# Altium schematic sheet buttons.SchDoc
size A4
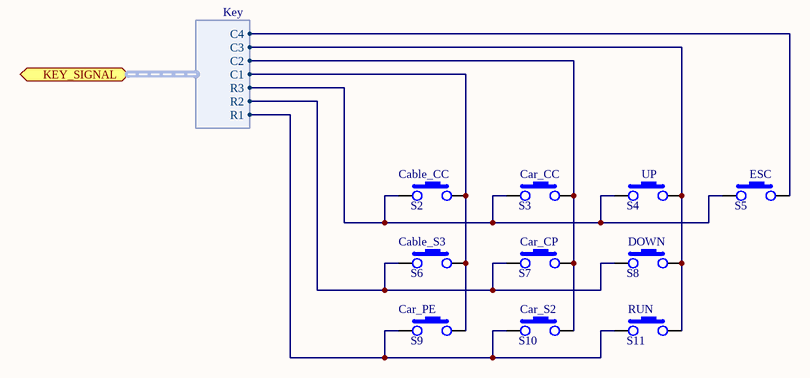
[diagram p0: buttons.SchDoc]

## Parts
S2  SKHCBJA010  [SKHCBJA010]  (value not drawn)
S3  SKHCBJA010  [SKHCBJA010]  (value not drawn)
S4  SKHCBJA010  [SKHCBJA010]  (value not drawn)
S5  SKHCBJA010  [SKHCBJA010]  (value not drawn)
S6  SKHCBJA010  [SKHCBJA010]  (value not drawn)
S7  SKHCBJA010  [SKHCBJA010]  (value not drawn)
S8  SKHCBJA010  [SKHCBJA010]  (value not drawn)
S9  SKHCBJA010  [SKHCBJA010]  (value not drawn)
S10  SKHCBJA010  [SKHCBJA010]  (value not drawn)
S11  SKHCBJA010  [SKHCBJA010]  (value not drawn)

## Ports
KEY_SIGNAL (harness Key)

## Harnesses
Key: R3, R2, R1, C4, C3, C2, C1

## Nets
NetS2_1: S2.1 S3.1 S4.1 S5.1 ; port KEY_SIGNAL.R3
NetS2_3: S2.3 S6.3 S9.3 ; port KEY_SIGNAL.C1
NetS3_3: S3.3 S7.3 S10.3 ; port KEY_SIGNAL.C2
NetS4_3: S4.3 S8.3 S11.3 ; port KEY_SIGNAL.C3
NetS5_3: S5.3 ; port KEY_SIGNAL.C4
NetS6_1: S6.1 S7.1 S8.1 ; port KEY_SIGNAL.R2
NetS9_1: S9.1 S10.1 S11.1 ; port KEY_SIGNAL.R1

## Notes on the sheet
- (near S2) Cable_CC
- (near S3) Car_CC
- (near S4) UP
- (near S5) ESC
- (near S6) Cable_S3
- (near S7) Car_CP
- (near S8) DOWN
- (near S9) Car_PE
- (near S10) Car_S2
- (near S11) RUN

## Library data of the parts
S2-S11 = SKHCBJA010: Alps tact switch 12x12